# EasyEDA Pro project ProProject_20240815-UR5-手部姿态控制板_2024-08-29.epro

# Schematic Schematic1
Create Date: 2024-08-15; Page Name: P1; Project Name: 20240815-UR5-手部姿态控制板; Schematic Name: Schematic1; Update Date: 2024-08-15; Company: 嘉立创EDA; Page Size: A4; Version: V1.0
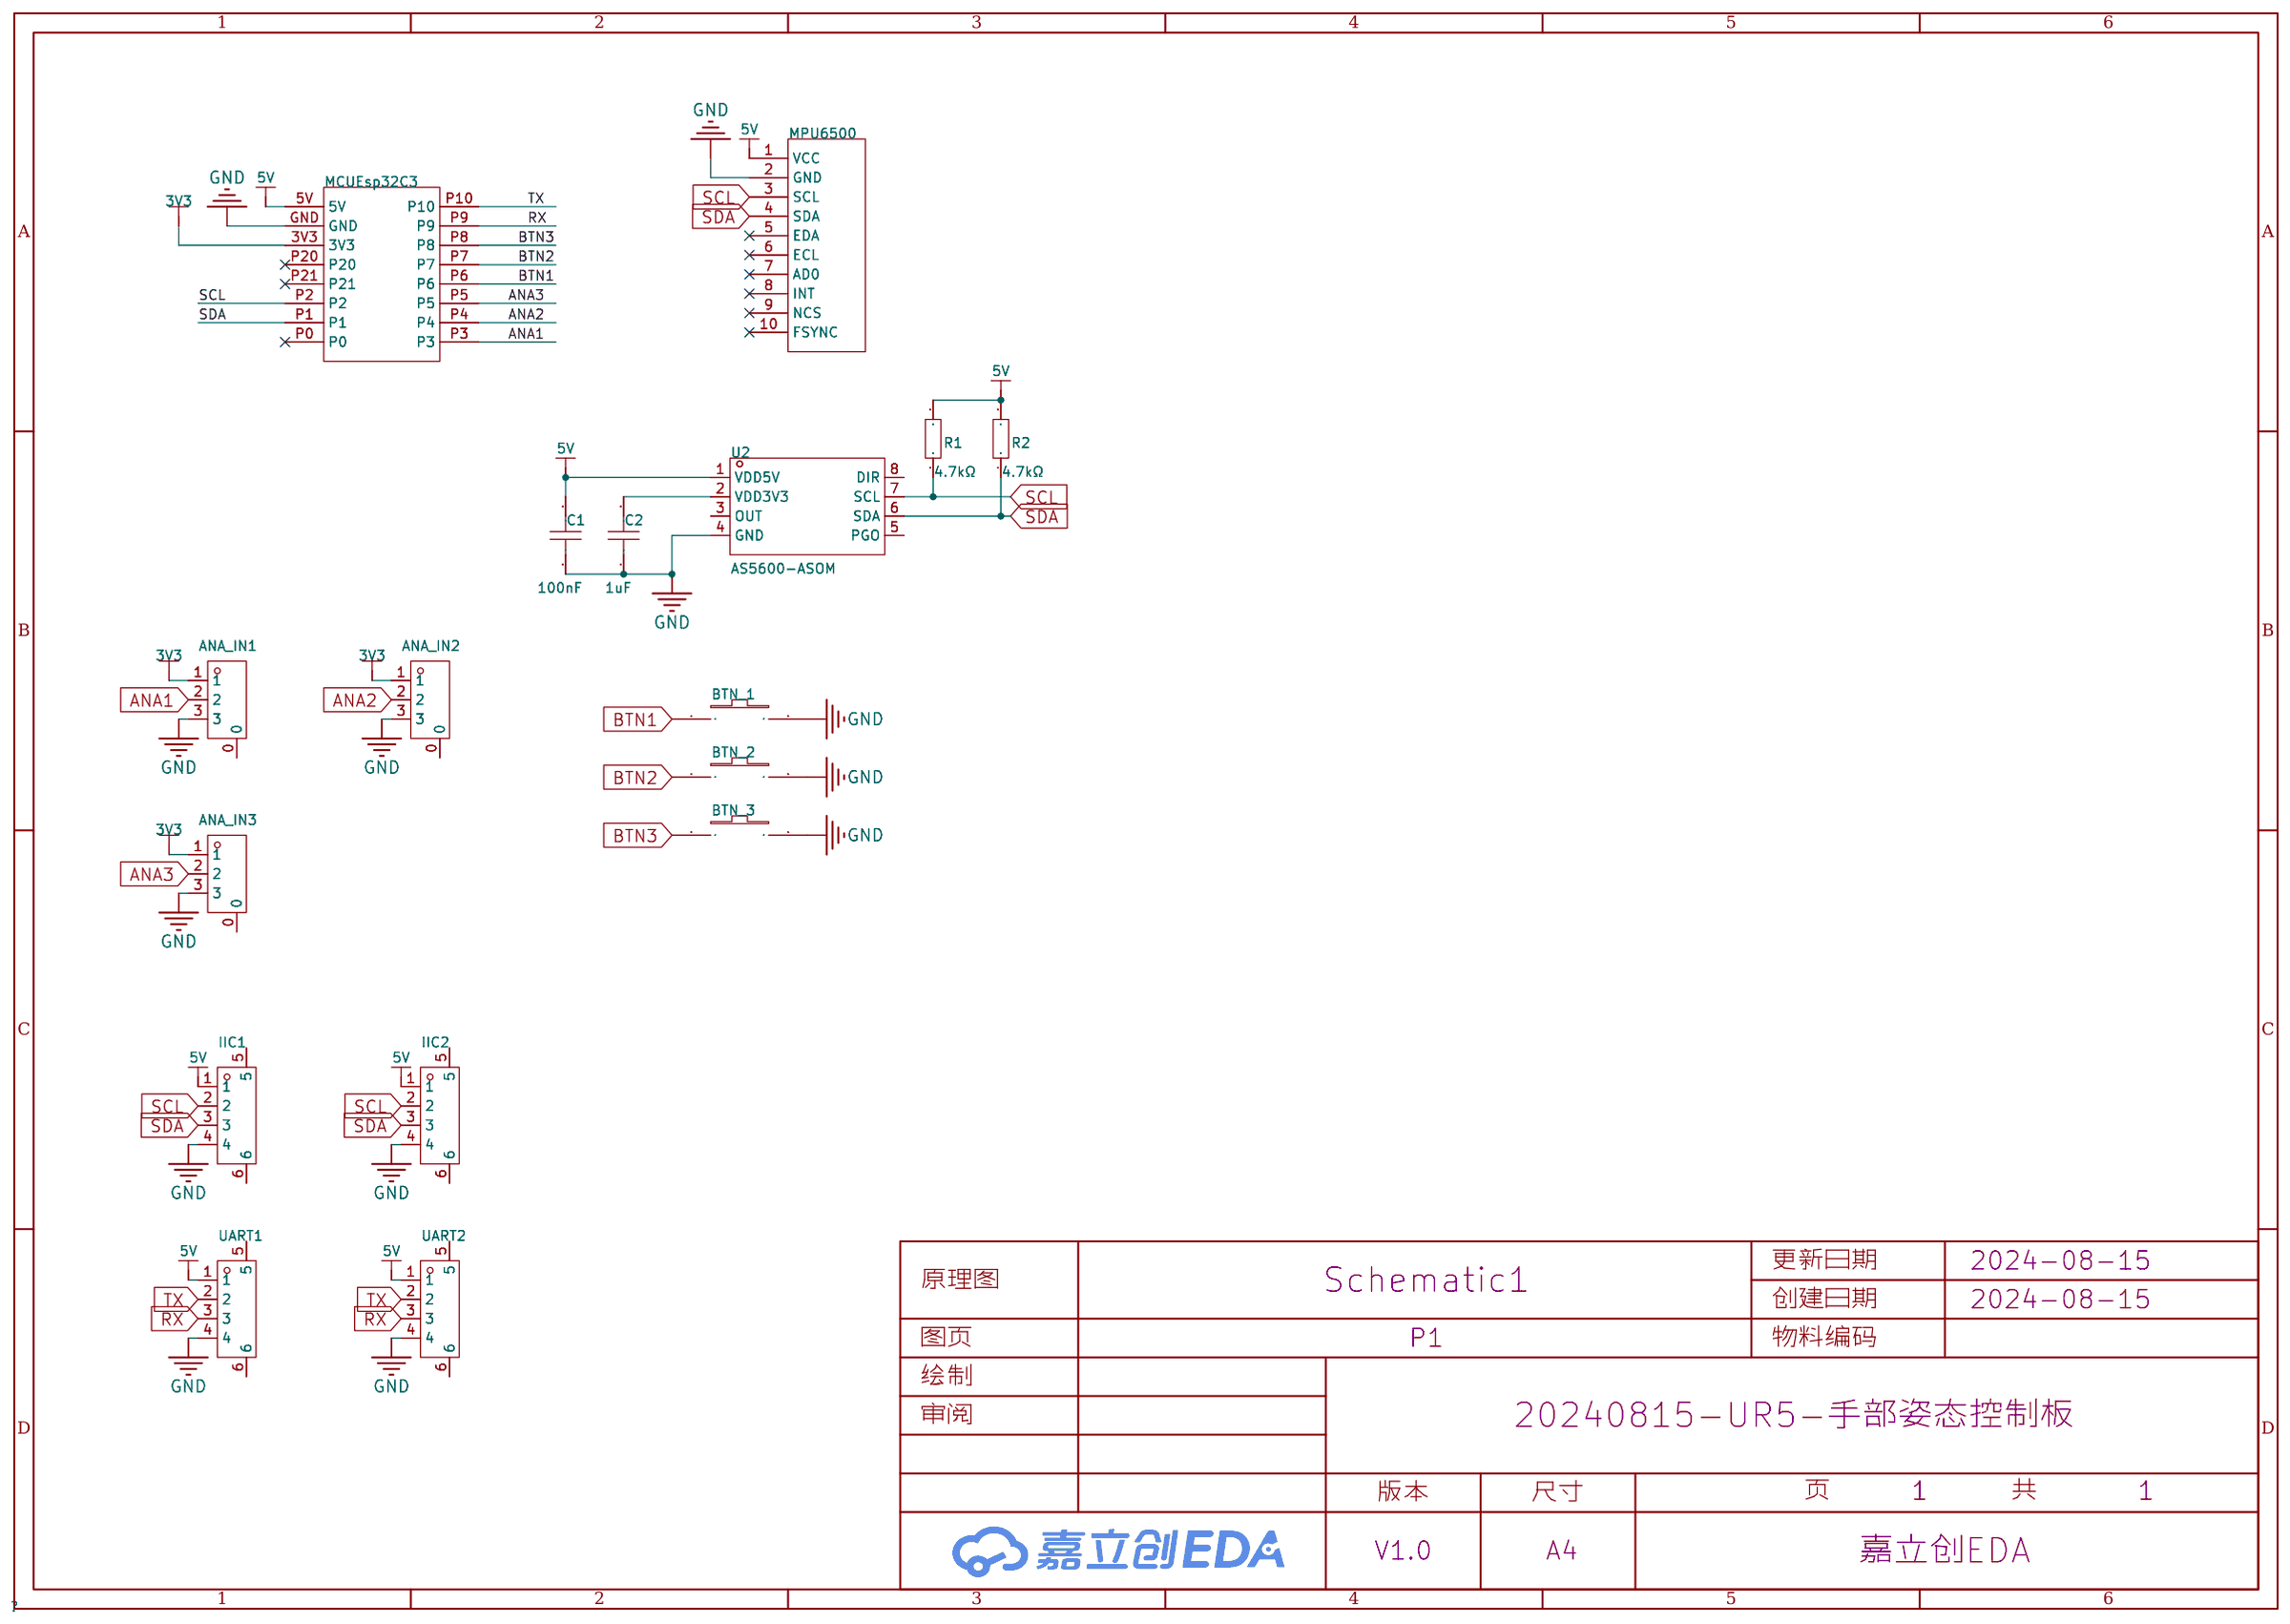
[diagram p0: schematic sheet]

## Parts
ANA_IN1  SH1.0-3P  [CONN-SMD_3P-P1.00-L5.0-W5.0]
ANA_IN2  SH1.0-3P  [CONN-SMD_3P-P1.00-L5.0-W5.0]
ANA_IN3  SH1.0-3P  [CONN-SMD_3P-P1.00-L5.0-W5.0]
BTN_1  K2-1104DZ-B4SW-04  [SW-TH_2P-L6.2-W6.2-P5.0]
BTN_2  K2-1104DZ-B4SW-04  [SW-TH_2P-L6.2-W6.2-P5.0]
BTN_3  K2-1104DZ-B4SW-04  [SW-TH_2P-L6.2-W6.2-P5.0]
C1  1uF  [C1206]
C2  1uF  [C1206]
IIC1  SH1.0 4P  [CONN-SMD_4P-P1.00_C9900013908]
IIC2  SH1.0 4P  [CONN-SMD_4P-P1.00_C9900013908]
MCUEsp32C3  -  [Esp32-C3-mini]
MPU6500  -  [6558模块]
R1  4.7kΩ  [R1206]
R2  4.7kΩ  [R1206]
U2  AS5600-ASOM  [SOIC-8_L5.0-W4.0-P1.27-LS6.0-BL]
UART1  SH1.0 4P  [CONN-SMD_4P-P1.00_C9900013908]
UART2  SH1.0 4P  [CONN-SMD_4P-P1.00_C9900013908]

## Library data of the parts
ANA_IN1-ANA_IN3 = SH1.0-3P: Supplier Part: C9900019066; JLCPCB Part Class: 扩展库; Supplier: LCSC
BTN_1-BTN_3 = K2-1104DZ-B4SW-04: 作用力:250gf;安装方式:直插;开关长度:6mm;开关宽度:6mm;开关高度:4.5mm;触点电流:50mA;额定电压(DC):12V;绝缘电阻:100MΩ;机械寿命:10万次;; LCSC Part Name: 6x6x4.5  两脚插件开关; Supplier Part: C2690025; Manufacturer: 韩国韩荣; Supplier Footprint: 插件; JLCPCB Part Class: 扩展库; Datasheet: https://atta.szlcsc.com/upload/public/pdf/source/20201126/C961736_4F85C6E6E5B3656D5DC7C0B00D034F4A.pdf; Supplier: LCSC; Operating Force: 250gf; Mounting Style: 直插; Switch Length: 6mm; Switch Width: 6mm; Switch Height: 4.5mm; Contact Current: 50mA; Voltage Rating (DC): 12V; Insulation Resistance: 100MΩ; Mechanical Life: 10万次; Operating Temperature: -25℃~+85℃
C1 C2 = CL31B105KBHNNNE: 容值:1uF;精度:±10%;额定电压:50V;材质(温度系数):X7R;; LCSC Part Name: 1uF ±10% 50V; Supplier Part: C1848; Manufacturer: SAMSUNG(三星); Supplier Footprint: 1206; JLCPCB Part Class: 基础库; Datasheet: https://atta.szlcsc.com/upload/public/pdf/source/20160218/1457707763339.pdf; Supplier: LCSC; Tolerance: ±10%; Voltage Rated: 50V; Temperature Coefficient: X7R
IIC1 IIC2 UART1 UART2 = SH1.0 4P: Supplier Part: C9900013908; Supplier Footprint: A100-4; JLCPCB Part Class: 扩展库; Supplier: LCSC
MCUEsp32C3 = Esp32-C3-mini
MPU6500 = MPU6500
R1 R2 = 1206W4F4701T5E: 电阻类型:厚膜电阻;阻值:4.7kΩ;精度:±1%;功率:250mW;最大工作电压:200V;温度系数:±100ppm/℃;; LCSC Part Name: 4.7kΩ ±1% 250mW 厚膜电阻; Supplier Part: C17936; Manufacturer: UNI-ROYAL(厚声); Supplier Footprint: 1206; JLCPCB Part Class: 基础库; Datasheet: https://atta.szlcsc.com/upload/public/pdf/source/20200306/C422600_1E6D84923E4A46A82E41ADD87F860B5C.pdf; Supplier: LCSC; Type: 厚膜电阻; Tolerance: ±1%; Power(Watts): 250mW; Overload Voltage (Max): 200V; Temperature Coefficient: ±100ppm/℃; Operating Temperature Range: -55℃~+155℃
U2 = AS5600-ASOM: 旋转角度范围:0°~360°;; Supplier Part: C79815; Manufacturer: ams(艾迈斯半导体); Supplier Footprint: SOIC-8; JLCPCB Part Class: 扩展库; Datasheet: https://atta.szlcsc.com/upload/public/pdf/source/20161027/1477535527192.pdf; Supplier: LCSC; Supply Voltage: 5V；3.3V; Rotation Angle: 0°~360°

## Nets
3V3: ANA_IN1.1 ANA_IN2.1 ANA_IN3.1 MCUEsp32C3.3V3
5V: C1.2 IIC1.1 IIC2.1 MCUEsp32C3.5V MPU6500.1(VCC) R1.2 R2.2 U2.1(VDD5V) UART1.1 UART2.1
GND: ANA_IN1.3 ANA_IN2.3 ANA_IN3.3 BTN_1.2 BTN_2.2 BTN_3.2 C1.1 C2.1 IIC1.4 IIC2.4 MCUEsp32C3.GND MPU6500.2(GND) U2.4(GND) UART1.4 UART2.4
ANA1: ANA_IN1.2 MCUEsp32C3.P3
ANA2: ANA_IN2.2 MCUEsp32C3.P4
ANA3: ANA_IN3.2 MCUEsp32C3.P5
BTN1: BTN_1.1 MCUEsp32C3.P6
BTN2: BTN_2.1 MCUEsp32C3.P7
BTN3: BTN_3.1 MCUEsp32C3.P8
RX: MCUEsp32C3.P9 UART1.3 UART2.3
SCL: IIC1.2 IIC2.2 MCUEsp32C3.P2 MPU6500.3(SCL) R1.1 U2.7(SCL)
SDA: IIC1.3 IIC2.3 MCUEsp32C3.P1 MPU6500.4(SDA) R2.1 U2.6(SDA)
TX: MCUEsp32C3.P10 UART1.2 UART2.2
$1N1241: C2.2 U2.2(VDD3V3)

Not connected (* = marked no-connect by the designer): ANA_IN1 0; ANA_IN2 0; ANA_IN3 0; IIC1 5 6; IIC2 5 6; MCUEsp32C3 P0* P20* P21*; MPU6500 5(EDA)* 6(ECL)* 7(AD0)* 8(INT)* 9(NCS)* 10(FSYNC)*; U2 3(OUT) 5(PGO) 8(DIR); UART1 5 6; UART2 5 6

# Board PCB1
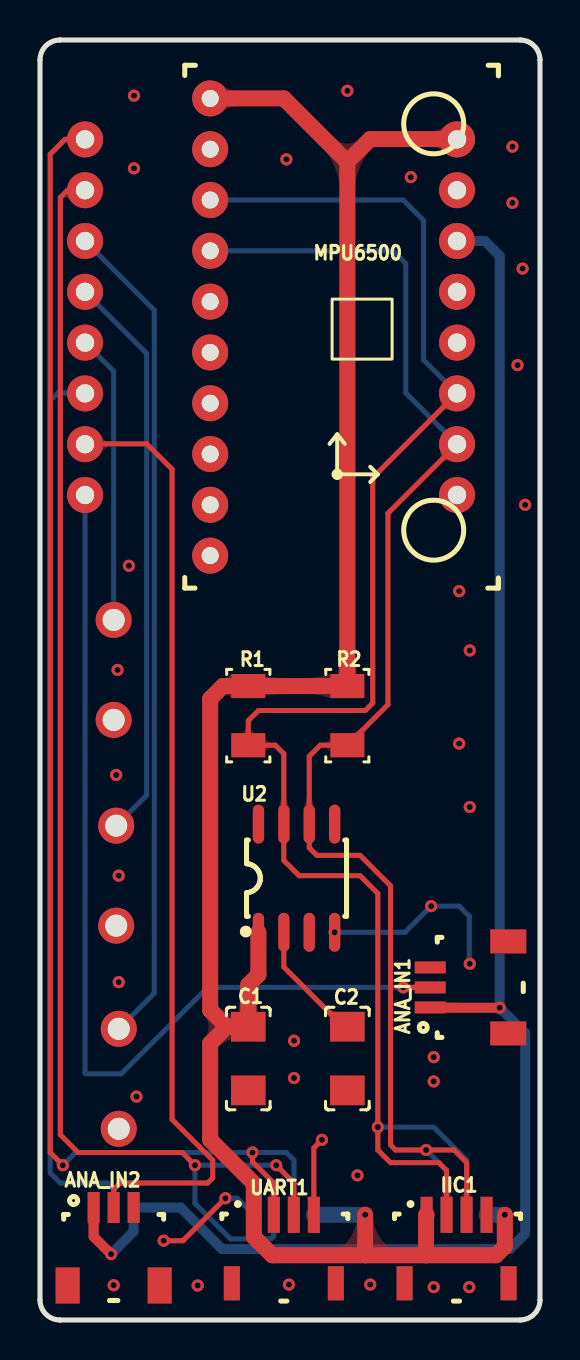
[diagram p1: board, top side]
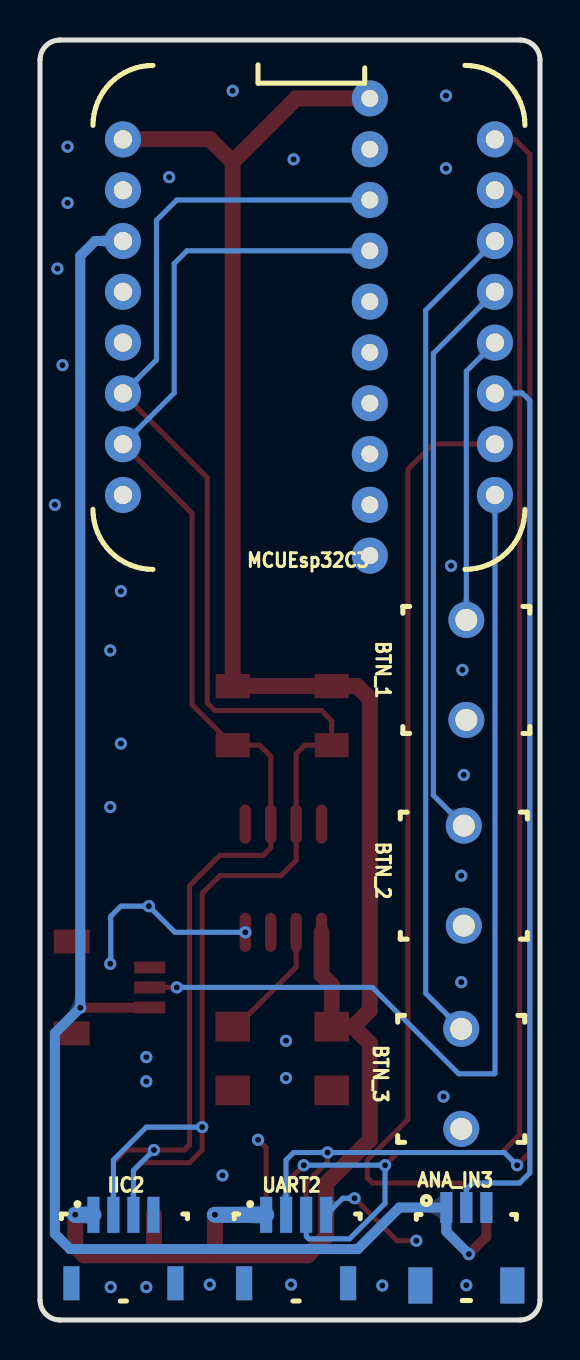
[diagram p2: board, bottom side, seen from below]

Outline 25 x 64 mm; copper layers: Top Layer, Bottom Layer. Coordinates in mm from the lower left corner of the outline.
Outline path: 0,63 0,1 arc(0.29,0.29) 1,0 24,0 arc(24.71,0.29) 25,1 25,63 arc(24.71,63.71) 24,64 1,64 arc(0.29,63.71) 0,63
Stack: Top Layer 0.035mm / Dielectric1 1.51mm FR4 er 4.5 / Bottom Layer 0.035mm

## Design rules (mm)
template: JLCPCB Capability(Two Layers Board)
spacing copperThickness1oz (default): track to track 0.102, other pairs 0.152 to 0.3
spacing copperThickness2oz: track to track 0.203, other pairs 0.152 to 0.3
track width copperThickness1oz (default): min 0.127, default 0.254, max 2.54
track width copperThickness2oz: min 0.203, default 0.254, max 2.54
differential pair differentialPair (default): width min 0.127, default 0.254, max 2.54; gap min 0.152, default 0.152
via viaSize (default): diameter min 0.5, default 0.61, max 10; hole min 0.3, default 0.305, max 6.3

## Placement (name value [footprint] x y rotation side)
ANA_IN1  SH1.0-3P  [CONN-SMD_3P-P1.00-L5.0-W5.0]  21.46 16.63 90 top
ANA_IN2  SH1.0-3P  [CONN-SMD_3P-P1.00-L5.0-W5.0]  3.68 3.68 0 top
ANA_IN3  SH1.0-3P  [CONN-SMD_3P-P1.00-L5.0-W5.0]  3.68 3.68 180 bottom
BTN_1  K2-1104DZ-B4SW-04  [SW-TH_2P-L6.2-W6.2-P5.0]  3.68 32.5 270 bottom
BTN_2  K2-1104DZ-B4SW-04  [SW-TH_2P-L6.2-W6.2-P5.0]  3.81 22.22 270 bottom
BTN_3  K2-1104DZ-B4SW-04  [SW-TH_2P-L6.2-W6.2-P5.0]  3.94 12.06 270 bottom
C1  1uF  [C1206]  10.41 13.07 90 top
C2  1uF  [C1206]  15.37 13.07 90 top
IIC1  SH1.0 4P  [CONN-SMD_4P-P1.00_C9900013908]  20.83 3.55 0 top
IIC2  SH1.0 4P  [CONN-SMD_4P-P1.00_C9900013908]  20.83 3.55 180 bottom
MCUEsp32C3  -  [Esp32-C3-mini]  22.35 62.73 180 bottom
MPU6500  -  [6558模块]  8.51 50.92 0 top
R1  4.7kΩ  [R1206]  10.41 30.22 90 top
R2  4.7kΩ  [R1206]  15.37 30.22 90 top
U2  AS5600-ASOM  [SOIC-8_L5.0-W4.0-P1.27-LS6.0-BL]  12.83 22.09 0 top
UART1  SH1.0 4P  [CONN-SMD_4P-P1.00_C9900013908]  12.19 3.55 0 top
UART2  SH1.0 4P  [CONN-SMD_4P-P1.00_C9900013908]  12.19 3.55 180 bottom

## Footprints (pads in the part's own frame, mm; a bottom-side part is the same pattern mirrored in y, then rotated)
6558模块
  round 1.8 hole 0.85: 1(0,10.16) 2(0,7.62) 3(0,5.08) 4(0,2.54) 5(0,0) 6(0,-2.54) 7(0,-5.08) 8(0,-7.62) 9(0,-10.16) 10(0,-12.7)
C1206
  rect 1.485x1.728 smd: 1(-1.593,0) 2(1.593,0)
CONN-SMD_3P-P1.00-L5.0-W5.0
  rect 1.2x1.8 smd: 0(-2.3,-1.95) 0(2.3,-1.95)
  rect 0.6x1.55 smd: 1(-1,1.95) 2(0,1.95) 3(1,1.95)
CONN-SMD_4P-P1.00_C9900013908
  rect 0.6x1.8 smd: 1(-1.5,1.712) 2(-0.5,1.712) 3(0.5,1.712) 4(1.5,1.712)
  rect 0.8x1.7 smd: 5(2.6,-1.712) 6(-2.6,-1.712)
Esp32-C3-mini
  round 1.8 hole 0.914x0.85: 3V3(1.5,-8.78) 5V(1.5,-3.7) GND(1.5,-6.24) P0(1.5,-21.48) P1(1.5,-18.94) P2(1.5,-16.4) P3(20.1,-21.48) P4(20.1,-18.94) P5(20.1,-16.4) P6(20.1,-13.86) P7(20.1,-11.32) P8(20.1,-8.78) P9(20.1,-6.24) P10(20.1,-3.7) P20(1.5,-11.32) P21(1.5,-13.86)
R1206
  rect 1.208x1.701 smd: 1(-1.479,0) 2(1.479,0)
SOIC-8_L5.0-W4.0-P1.27-LS6.0-BL
  oval 0.569x1.95 smd: 1(-1.905,-2.705) 2(-0.635,-2.705) 3(0.635,-2.705) 4(1.905,-2.705) 5(1.905,2.705) 6(0.635,2.705) 7(-0.635,2.705) 8(-1.905,2.705)
SW-TH_2P-L6.2-W6.2-P5.0
  round 1.8 hole 1.1x0.85: 1(-2.5,0) 2(2.5,0)

## Nets
As in the schematic.

Pads without a net: ANA_IN1 0; ANA_IN2 0; ANA_IN3 0; IIC1 5 6; IIC2 5 6; MCUEsp32C3 P0 P20 P21; MPU6500 5 6 7 8 9 10; U2 3 5 8; UART1 5 6; UART2 5 6

## Via types
v1: diameter 0.61, hole 0.305, Top Layer to Bottom Layer, 48 vias

## Routing (per net, layer and track width the routed paths; a pad name or vN(x,y) marks a point on that pad's centre or on a via; arc(x,y) is an arc through that point)
3V3: length 81.6
  Top Layer w0.5: v1(3.56,3.29) 2.68,4.17 ANA_IN2.1 ; v1(22.99,15.61) 19.53,15.61 ANA_IN1.1
  Bottom Layer w0.5: v1(3.56,3.29) 4.68,4.42 ANA_IN3.1 7.03,5.62 9.11,3.55 23.5,3.55 24.26,4.31 24.26,14.34 v1(22.99,15.61) 22.99,53.2 22.24,53.95 MCUEsp32C3.3V3
5V: length 104.2
  Top Layer w0.8: v1(23.24,5.26) 23.24,3.68 22.8,3.24 19.3,3.24 ; 15.37,57.9 12.19,61.08 MPU6500.1 ; 15.37,57.9 16.51,59.05 20.84,59.05 MCUEsp32C3.5V ; 15.37,57.9 R2.2 R1.2 9.14,31.7 8.51,31.06 8.51,15.5 9.34,14.67 ; 9.34,14.67 8.51,13.83 8.51,9.01 10.69,6.83 UART1.1 10.69,4.16 11.61,3.24 16.26,3.24 ; 9.34,14.67 C1.2 10.41,16.76 10.92,17.26 U2.1 ; 16.26,3.24 19.3,3.24 ; 16.26,3.24 v1(16.26,5.26) ; 19.3,3.24 19.3,5.24 IIC1.1
  Bottom Layer w0.8: UART2.1 v1(16.26,5.26) ; IIC2.1 v1(23.24,5.26)
GND: length 19.5
  Top Layer w0.254: v1(14.1,9.01) 13.69,8.6 UART1.4 ; v1(6.18,3.96) 7.15,3.96 v1(9.27,6.09)
  Bottom Layer w0.254: v1(9.27,6.09) 9.86,6.09 UART2.4 ; v1(14.73,19.39) 18.25,19.39 v1(19.56,20.69) 20.96,20.69 21.46,20.19 21.46,17.83 v1(21.49,17.81)
  vias: v1(3.68,1.74) v1(3.81,27.25) v1(3.88,32.5) v1(3.94,22.22) v1(3.94,16.89) v1(4.44,37.71) v1(4.7,61.22) v1(4.7,57.58) v1(4.83,11.17) v1(7.88,1.72) v1(12.32,58.03) v1(12.45,1.77) v1(12.7,13.96) v1(12.7,12.1) v1(15.37,61.46) v1(15.88,7.23) v1(16.51,1.77) v1(18.54,57.14) v1(19.69,13.14) v1(19.69,11.93) v1(19.69,1.64) v1(20.96,36.44) v1(20.96,28.82) v1(21.49,33.48) v1(21.49,25.65) v1(21.46,1.64) v1(23.62,58.67) v1(23.62,55.86) v1(23.88,47.74) v1(24.13,52.57) v1(24.26,40.76)
ANA1: length 48
  Top Layer w0.254: ANA_IN1.2 v1(18.16,16.63)
  Bottom Layer w0.254: MCUEsp32C3.P3 2.25,12.34 2.29,12.31 4.06,12.31 8.38,16.63 v1(18.16,16.63)
ANA2: length 47.3
  Top Layer w0.254: MCUEsp32C3.P4 2.27,43.81 5.33,43.81 6.6,42.54 6.6,10.02 8.64,7.99 8.64,7.1 8.38,6.85 4.01,6.85 3.68,6.53 ANA_IN2.2
ANA3: length 44.9
  Bottom Layer w0.254: ANA_IN3.2 3.68,6.53 3.36,6.85 1.02,6.85 0.51,7.36 0.51,45.97 0.89,46.35 2.24,46.35 MCUEsp32C3.P5
BTN1: length 14.5
  Bottom Layer w0.254: BTN_1.1 3.68,47.44 MCUEsp32C3.P6
BTN2: length 28.6
  Bottom Layer w0.254: MCUEsp32C3.P7 5.33,48.33 5.33,26.24 BTN_2.1
BTN3: length 41.6
  Bottom Layer w0.254: MCUEsp32C3.P8 5.72,50.49 5.72,16.33 BTN_3.1
RX: length 70.2
  Top Layer w0.254: UART1.3 12.69,6.86 v1(11.81,7.74) ; v1(7.75,7.74) 7.11,8.37 1.91,8.37 1.02,9.26 1.02,56.13 1.38,56.49 MCUEsp32C3.P9
  Bottom Layer w0.254: UART2.3 11.68,5.25 11.68,4.18 11.56,4.06 9.53,4.06 7.75,5.83 v1(7.75,7.74) v1(11.81,7.74)
SCL: length 84.9
  Top Layer w0.254: IIC1.2 20.32,5.27 20.32,7.48 19.94,7.87 17.53,7.87 16.89,8.5 v1(16.89,9.64) 16.89,21.33 16,22.22 12.95,22.22 12.19,22.98 U2.7 12.19,28.31 11.77,28.74 R1.1 10.41,29.96 10.92,30.47 16.26,30.47 16.64,30.85 16.64,42.11 MCUEsp32C3.P2
  Bottom Layer w0.254: v1(16.89,9.64) 19.69,9.64 21.33,8 IIC2.2 ; MPU6500.3 18.16,56 19.18,54.98 19.18,48 MCUEsp32C3.P2
SDA: length 72.4
  Top Layer w0.254: MCUEsp32C3.P1 17.4,40.34 17.4,30.77 R2.1 14.01,28.74 13.46,28.19 U2.6 13.46,23.61 13.84,23.23 16,23.23 17.53,21.71 17.53,8.75 17.78,8.5 v1(19.3,8.5) 20.7,8.5 21.34,7.87 21.34,5.27 IIC1.3
  Bottom Layer w0.254: MPU6500.4 17.65,53.46 18.29,52.82 18.29,46.35 MCUEsp32C3.P1 ; IIC2.3 20.33,7.48 v1(19.3,8.5)
TX: length 71.1
  Top Layer w0.254: v1(10.62,8.37) 10.62,7.91 11.69,6.84 UART1.2 ; v1(1.14,7.74) 0.51,8.37 0.51,58.28 1.25,59.03 MCUEsp32C3.P10
  Bottom Layer w0.254: v1(1.14,7.74) 1.78,8.37 v1(10.62,8.37) 12.32,8.37 12.7,7.99 12.7,5.27 UART2.2
$1N1241: length 6.1
  Top Layer w0.254: C2.2 15.17,14.67 12.19,17.64 U2.2

## Copper pours and planes (outline as drawn; the poured copper is in the pictures)
GND on Top Layer: -2.03,65.4 26.54,65.4 26.54,-3.31 -2.03,-3.31
GND on Bottom Layer: -4.83,66.03 29.46,66.03 29.46,-3.56 -4.83,-3.56

Small or netless copper shapes (teardrops, artwork), in the pictures only: 47 on Top Layer, 37 on Bottom Layer
